# Altium schematic sheet MCU_AFE_Power.SchDoc
size A4; SheetNumber: 3; SheetTotal: 4
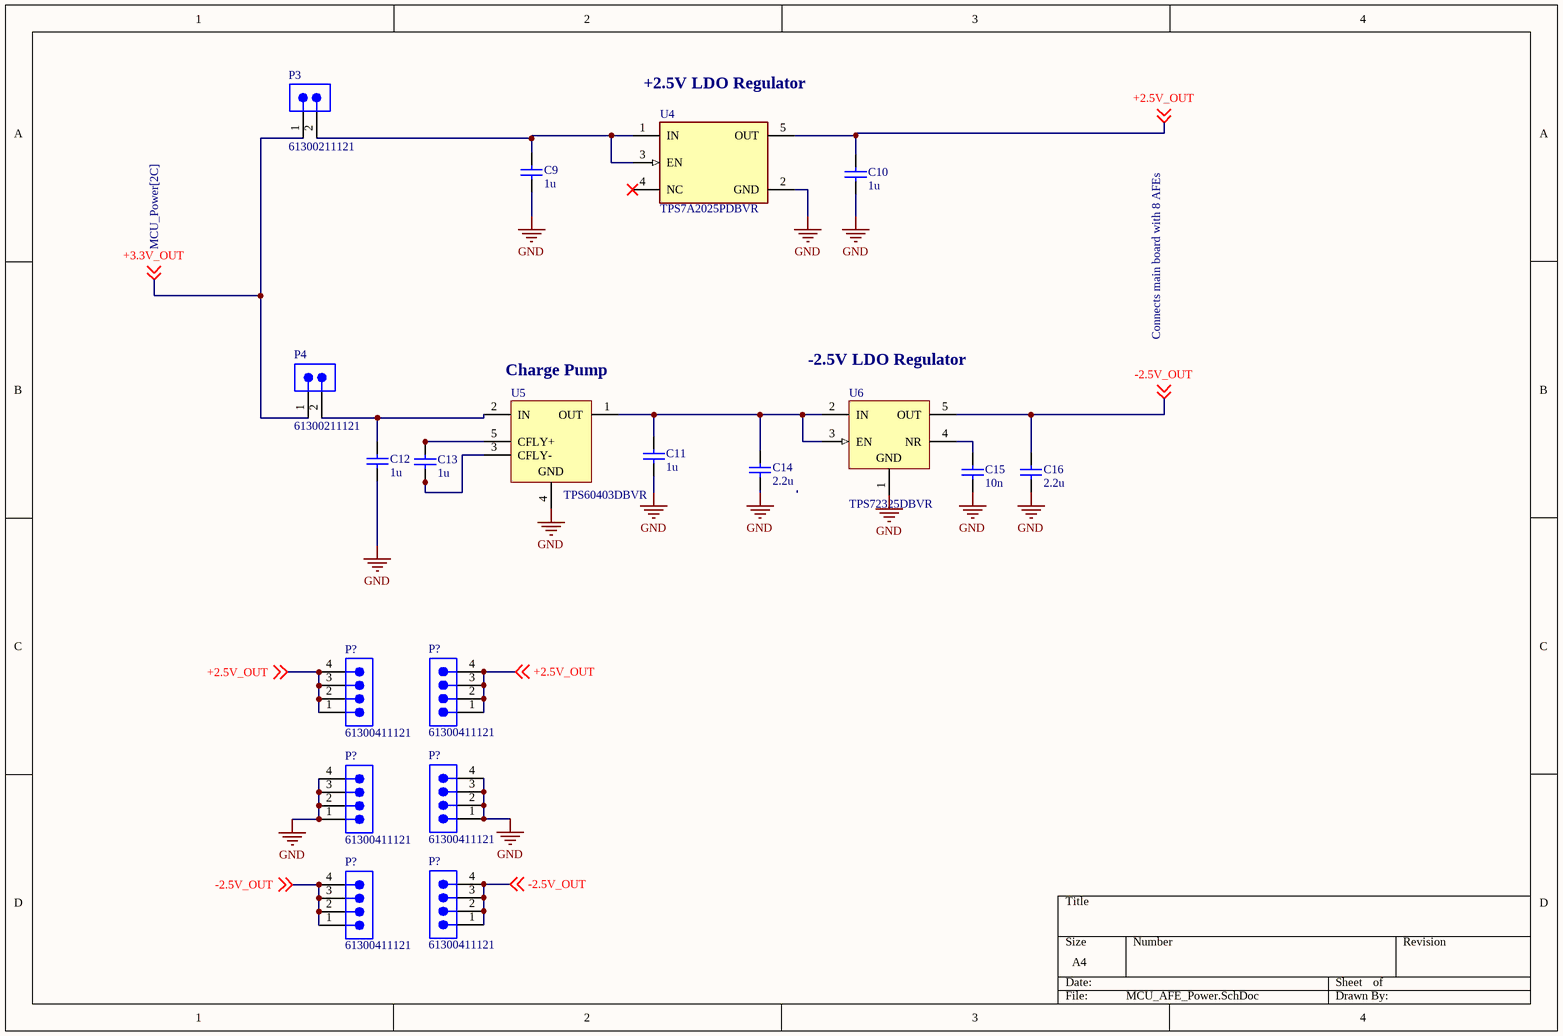
[diagram p0: MCU_AFE_Power.SchDoc]

## Parts
(Parts that share a designator on the sheet are numbered #1, #2 ... from top to bottom, then left to right.)
C9  1u  [WCAP-CSGP_0402_L1W0.5H0.5]
C10  1u  [WCAP-CSGP_0402_L1W0.5H0.5]
C11  1u  [WCAP-CSGP_0402_L1W0.5H0.5]
C12  1u  [WCAP-CSGP_0402_L1W0.5H0.5]
C13  1u  [WCAP-CSGP_0402_L1W0.5H0.5]
C14  2.2u  [WCAP-CSGP_0402_L1W0.5H0.5]
C15  10n  [WCAP-CSGP_0402_L1W0.5H0.5]
C16  2.2u  [WCAP-CSGP_0402_L1W0.5H0.5]
P3  61300211121  [61300211121]
P4  61300211121  [61300211121]
P?#1  61300411121  [61300411121]
P?#2  61300411121  [61300411121]
P?#3  61300411121  [61300411121]
P?#4  61300411121  [61300411121]
P?#5  61300411121  [61300411121]
P?#6  61300411121  [61300411121]
U4  TPS7A2025PDBVR  [FP-DBV0005A-MFG]
U5  TPS60403DBVR  [DBV0005A_M]
U6  TPS72325DBVR  [DBV0005A_N]

## Nets
GND: C9.1 C10.1 C11.1 C12.1 C14.1 C15.1 C16.1 P?#3.1 P?#3.2 P?#3.3 P?#3.4 P?#4.1 P?#4.2 P?#4.3 P?#4.4 U4.2(GND) U5.4(GND) U6.1(GND)
+2.5V_OUT: C10.2 P?#1.1 P?#1.2 P?#1.3 P?#1.4 P?#2.1 P?#2.2 P?#2.3 P?#2.4 U4.5(OUT) ; off-sheet +2.5V_OUT
+3.3V_OUT: P3.1 P4.1 ; off-sheet +3.3V_OUT
-2.5V_OUT: C16.2 P?#5.1 P?#5.2 P?#5.3 P?#5.4 P?#6.1 P?#6.2 P?#6.3 P?#6.4 U6.5(OUT) ; off-sheet -2.5V_OUT
NetC9_2: C9.2 P3.2 U4.1(IN) U4.3(EN)
NetC11_2: C11.2 C14.2 U5.1(OUT) U6.2(IN) U6.3(EN)
NetC12_2: C12.2 P4.2 U5.2(IN)
NetC13_1: C13.1 U5.3(CFLY-)
NetC13_2: C13.2 U5.5(CFLY+)
NetC15_2: C15.2 U6.4(NR)

Not connected (* = marked no-connect by the designer): U4 4(NC)*

## Notes on the sheet
- (near U4) +2.5V LDO Regulator
- (near U5) Charge Pump
- (near U6) -2.5V LDO Regulator
- Connects main board with 8 AFEs

## Library data of the parts
C9-C16 = CMP-207839-000017-2: CAP CER 10000PF 50V X7R 0402; NexarPartId: 53703204; Insulation Resistance: 10GΩ; Material: Ceramic; Tolerance: 10%; Capacitance: 10nF; Packaging: Tape & Reel (TR); Voltage Rating: 50V; Thickness: 558.8µm; Case Code (Imperial): 0402; Dielectric: X7R; Mount: Surface Mount; Width: 500µm; Height: 500µm; Min Operating Temperature: -55°C; Case/Package: 0402; RoHS: Compliant; Case Code (Metric): 1005; REACH SVHC: Unknown; Max Operating Temperature: 125°C; Voltage Rating (DC): 50V; Length: 1mm
P3 P4 = CMP-1712-00002-6: NexarPartId: 20081794; Number of Contacts: 2; Pitch: 2.54mm; Connector Type: Male Pin; Voltage Rating: 250V; Current Rating: 3A; Gender: Male; Contact Resistance: 20mΩ; Height: 8.94mm; Lead Free: Lead Free; Number of Pins: 2; Termination: Through Hole; RoHS: Compliant; Lead Pitch: 2.54mm; REACH SVHC: No SVHC; Housing Material: PBT; Contact Mating Length: 5.9944mm; Min Operating Temperature: -40°C; Orientation: Vertical; Contact Material: Copper; Contact Gender: Male; Max Operating Temperature: 125°C; Number of Rows: 1; Number of Positions: 2; Packaging: Bulk; Contact Plating: Gold; Mount: Through Hole; Color: Black; Operating Supply Voltage: 250V
P?#1-P?#6 = CMP-1502-01064-3: NexarPartId: 32855522; Operating Supply Voltage: 250V; Pitch: 2.54mm; Contact Resistance: 20mΩ; Number of Positions: 4; Current Rating: 3A; Connector Type: Male Pin; Gender: Male; Contact Plating: Gold; Height: 8.89mm; Lead Pitch: 2.54mm; Lead Free: Lead Free; Contact Mating Length: 5.9944mm; Number of Rows: 1; Termination: Solder; Packaging: Bulk; REACH SVHC: Unknown; Min Operating Temperature: -40°C; RoHS: Compliant; Number of Contacts: 4; Voltage Rating: 250V; Color: Black; Max Operating Temperature: 105°C; Contact Material: Copper; Mount: Through Hole; Orientation: Vertical; Number of Pins: 4
U4 = CMP-04917-000288-1: IC REG LINEAR 2.5V 300MA SOT23-5; RoHS Compliant: Yes
U5 = CMP-0391-00006-2: -1.8 to -5.25 V, Inverting Charge Pump Regulator, 60 mA, 1.8 to 5.25 V Input with 2-Cell Alkaline / Nixx Input, -40 to 85 degC, 5-pin SOT23 (DBV5), Green (RoHS & no Sb/Br); Manufacturer: Texas Instruments; Iout(Max)(A): 0.06; Topology: Inverting Buck/Boost; Vin(Max)(V): 5.25; Iq(Typ)(mA): 0.425; Vin(Min)(V): 1.8; Switching Frequency(Max)(kHz): 300; 2-Cell Alkaline/Nixx Input: TRUE; Efficiency(Typ)(%): 99; DatasheetVersion: SLVS324A; PackageVersion: 4073253-4/K; Vout(Min)(V): -1.8; PartNumber: TPS60403DBVR; ComponentLink2URL: http://www.ti.com/general/docs/lit/getliterature.tsp?genericPartNumber=TPS60403&fileType=pdf; ComponentLink1URL: http://www.ti.com/; PackageDescription: 5-Pin Plastic Small Outline, Body 1.60 Ãƒâ€” 2.90 mm, Pitch 0.95 mm; Vout(Max)(V): -5.25; Mounting Technology: Surface Mount; Eco-Plan: Green (RoHS & no Sb/Br); PackageReference: DBV0005A; ComponentLink3Description: Package Specification; ComponentLink3URL: http://www.ti.com/litv/pdf/mpds018i; ComponentLink2Description: Datasheet; ComponentLink1Description: Manufacturer URL; Code_JEDEC: MO-178
U6 = CMP-0394-00292-2: Single Output High PSRR LDO, 200 mA, Fixed -2.5 V Output, -10 to -2.7 V Input, 5-pin SOT-23 (DBV), -40 to 125 degC, Green (RoHS & no Sb/Br); Manufacturer: Texas Instruments; Iout(Max)(A): 0.2; Iq(Typ)(mA): 0.13; Accuracy(%): 2; Vdo(Typ)(mV): 280; SubFamily: Single Channel LDO; Vin(Max)(V): -2.7; PartNumber: TPS72325DBVR; PackageReference: DBV0005A; ComponentLink3Description: Package Specification; Fixed Output Options(V): -2.5; ComponentLink1URL: http://www.ti.com/; ComponentLink1Description: Manufacturer URL; Mounting Technology: Surface Mount; PackageDescription: 5-Pin Plastic Small Outline, Body 1.60 Ãƒâ€” 2.90 mm, Pitch 0.95 mm; ComponentLink2URL: http://www.ti.com/general/docs/lit/getliterature.tsp?genericPartNumber=TPS72325&fileType=pdf; PackageVersion: 4073253-4/K; ComponentLink3URL: http://www.ti.com/litv/pdf/mpds018i; Vout Adj(Min)(V): -2.5; ComponentLink2Description: Datasheet; Vout Adj(Max)(V): -2.5; Eco-Plan: Green (RoHS & no Sb/Br); DatasheetVersion: SLVS346B; Vin(Min)(V): -10; Code_JEDEC: MO-178